# EAGLE design EspToPms7003 (EAGLE 9.6.2)
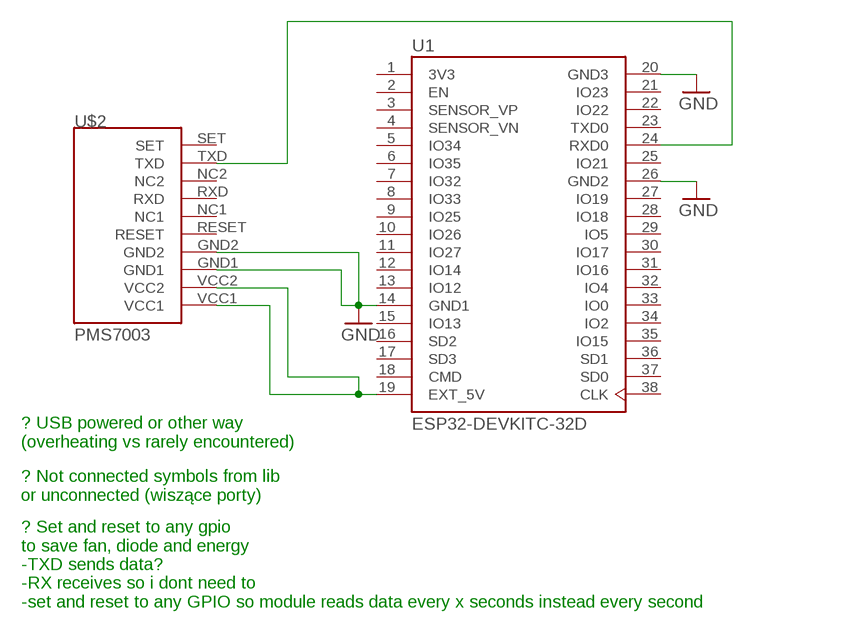
[diagram p0: schematic, sheet 1]

## Parts
U1  ESP32-DEVKITC-32D  [MODULE_ESP32-DEVKITC-32D]
U$2  PMS7003  [PMS7003]

## Nets
GND: U1.14(GND1) U1.20(GND3) U1.26(GND2) U$2.GND1 U$2.GND2
N$3: U1.24(RXD0) U$2.TXD
N$4: U1.19(EXT_5V) U$2.VCC1 U$2.VCC2
Unconnected: U1.2(EN) U1.3(SENSOR_VP) U1.4(SENSOR_VN) U1.5(IO34) U1.6(IO35) U1.7(IO32) U1.8(IO33) U1.9(IO25) U1.10(IO26) U1.11(IO27) U1.12(IO14) U1.13(IO12) U1.15(IO13) U1.16(SD2) U1.17(SD3) U1.18(CMD) U1.21(IO23) U1.22(IO22) U1.23(TXD0) U1.25(IO21) U1.27(IO19) U1.28(IO18) U1.29(IO5) U1.30(IO17) U1.31(IO16) U1.32(IO4) U1.33(IO0) U1.34(IO2) U1.35(IO15) U1.36(SD1) U1.37(SD0) U1.38(CLK) U$2.NC1 U$2.NC2 U$2.RESET U$2.RXD U$2.SET

## Notes on the sheet
- ? USB powered or other way 
  (overheating vs rarely encountered)
- ? Not connected symbols from lib
  or unconnected (wiszące porty)
- ? Set and reset to any gpio 
  to save fan, diode and energy
  -TXD sends data?
  -RX receives so i dont need to
  -set and reset to any GPIO so module reads data every x seconds instead every second

## Power pins joined to a net without a drawn wire
3V3: U1.1(3V3)

## Library data of the parts
U1 = ESP32-DEVKITC-32D:ESP32-DEVKITC-32D: Eval Board For Esp-Wroom-32 Check prices <https://pricing.snapeda.com/parts/ESP32-DEVKITC-32D/Espressif%20Systems/view-part?ref=eda>; AVAILABILITY: In Stock; DESCRIPTION: WiFi Development Tools (802.11) ESP32 General Development Kit, ESP32-WROOM-32D on the board; MF: Espressif Systems; MP: ESP32-DEVKITC-32D; PACKAGE: None; PRICE: None; PURCHASE-URL: https://pricing.snapeda.com/search/part/ESP32-DEVKITC-32D/?ref=eda
U$2 = pmMeasureProject:PMS7003

## Board
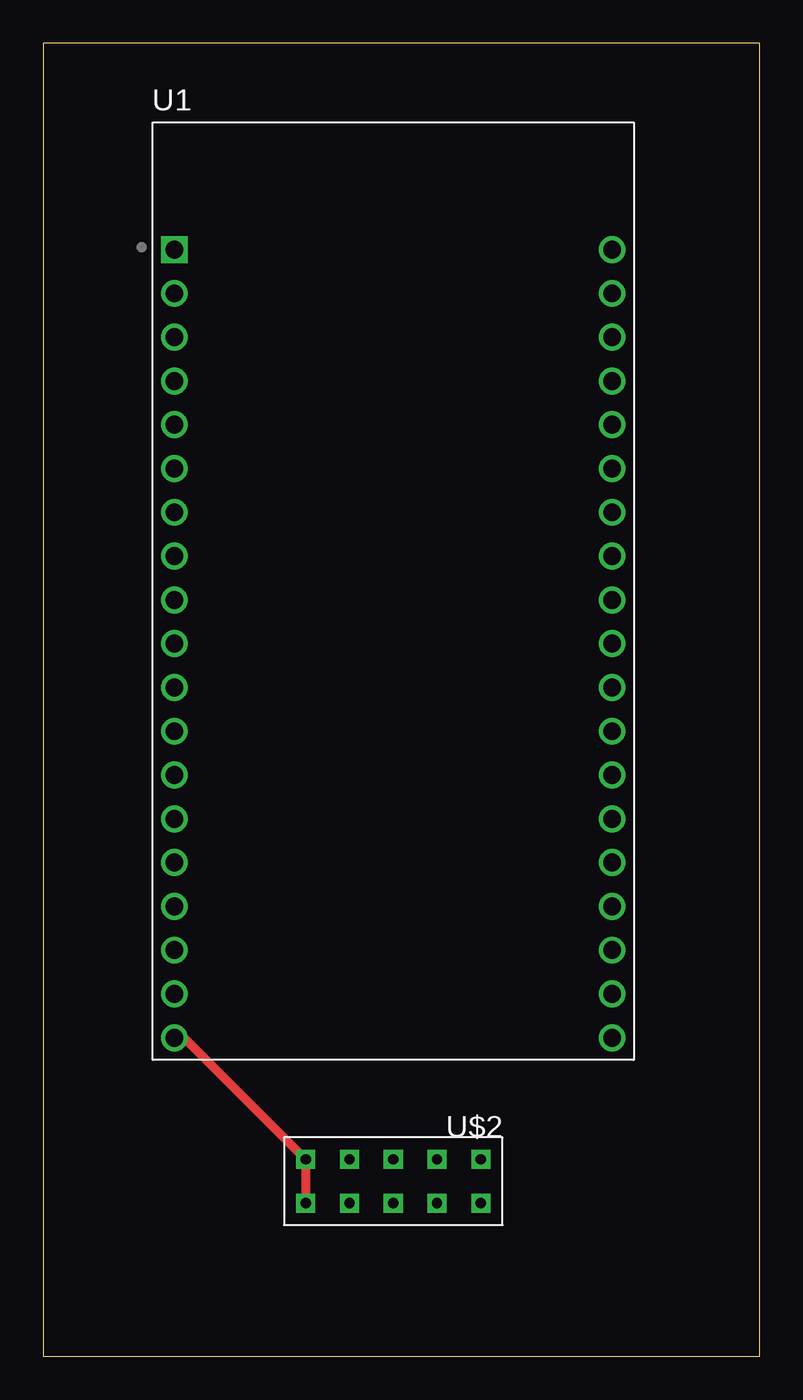
[diagram p1: board, top side]
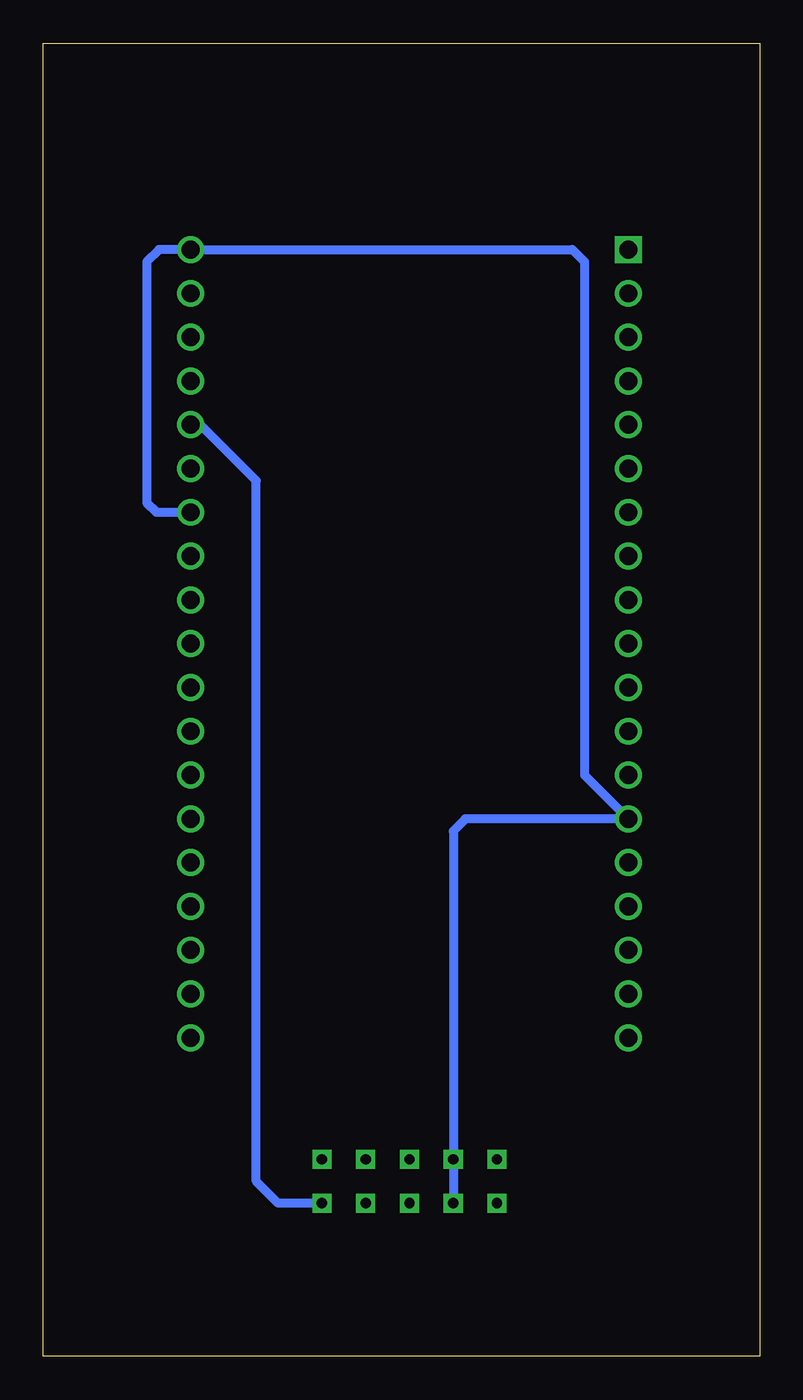
[diagram p2: board, bottom side, seen from below]

Size 41.58 x 76.19 mm. Coordinates in mm from the lower left corner, seen from the top.
Outline: 0,0 41.58,0 41.58,76.19 0,76.19 0,0
Copper layers (1*16): Top 0.035mm / dielectric 1.5mm / Bottom 0.035mm
Design rules "default": minimum track width 6mil, minimum drill 0.35mm, track to track 6mil, track to pad 6mil, pad to pad 6mil, via to via 6mil, smd to smd 6mil, copper to edge 40mil, drill to drill 6mil, minimum pad ring 10mil, minimum via ring 8mil, stop-mask expansion 4mil, vias tented up to drill 0mil, thermal gap 10mil

### Footprints (pad centres in the part's own frame; a part is rotated, then mirrored left to right if it is on the bottom)
MODULE_ESP32-DEVKITC-32D = drill 1.04 square: 1 -12.7,19.76 | drill 1.04: 2 -12.7,17.22; 3 -12.7,14.68; 4 -12.7,12.14; 5 -12.7,9.6; 6 -12.7,7.06; 7 -12.7,4.52; 8 -12.7,1.98; 9 -12.7,-0.56; 10 -12.7,-3.1; 11 -12.7,-5.64; 12 -12.7,-8.18; 13 -12.7,-10.72; 14 -12.7,-13.26; 15 -12.7,-15.8; 16 -12.7,-18.34; 17 -12.7,-20.88; 18 -12.7,-23.42; 19 -12.7,-25.96; 20 12.7,19.76; 21 12.7,17.22; 22 12.7,14.68; 23 12.7,12.14; 24 12.7,9.6; 25 12.7,7.06; 26 12.7,4.52; 27 12.7,1.98; 28 12.7,-0.56; 29 12.7,-3.1; 30 12.7,-5.64; 31 12.7,-8.18; 32 12.7,-10.72; 33 12.7,-13.26; 34 12.7,-15.8; 35 12.7,-18.34; 36 12.7,-20.88; 37 12.7,-23.42; 38 12.7,-25.96
PMS7003 = drill 0.6 square: GND1 2.54,2.54; GND2 2.54,0; NC1 0,0; NC2 -2.54,0; RESET 0,2.54; RXD -2.54,2.54; SET -5.08,0; TXD -5.08,2.54; VCC1 5.08,2.54; VCC2 5.08,0

### Placement (x,y rotation side)
U1  20.32,44.45 0 top
U$2  20.32,11.43 180 top

### Tracks (layer width: path | path; a pad name or v marks a point on that pad's centre or on a via)
GND
  Bottom 0.508: U1.26 35,48.97 35.56,49.53 35.56,63.5 34.85,64.21 U1.20 10.87,64.21 10.16,63.5 10.16,33.73 U1.14 17.07,31.19 17.78,30.48 U$2.GND2 U$2.GND1
N$3
  Bottom 0.508: U$2.TXD 27.94,8.89 29.21,10.16 29.21,50.8 32.46,54.05 U1.24
N$4
  Top 0.508: U1.19 8.18,18.49 U$2.VCC2 U$2.VCC1